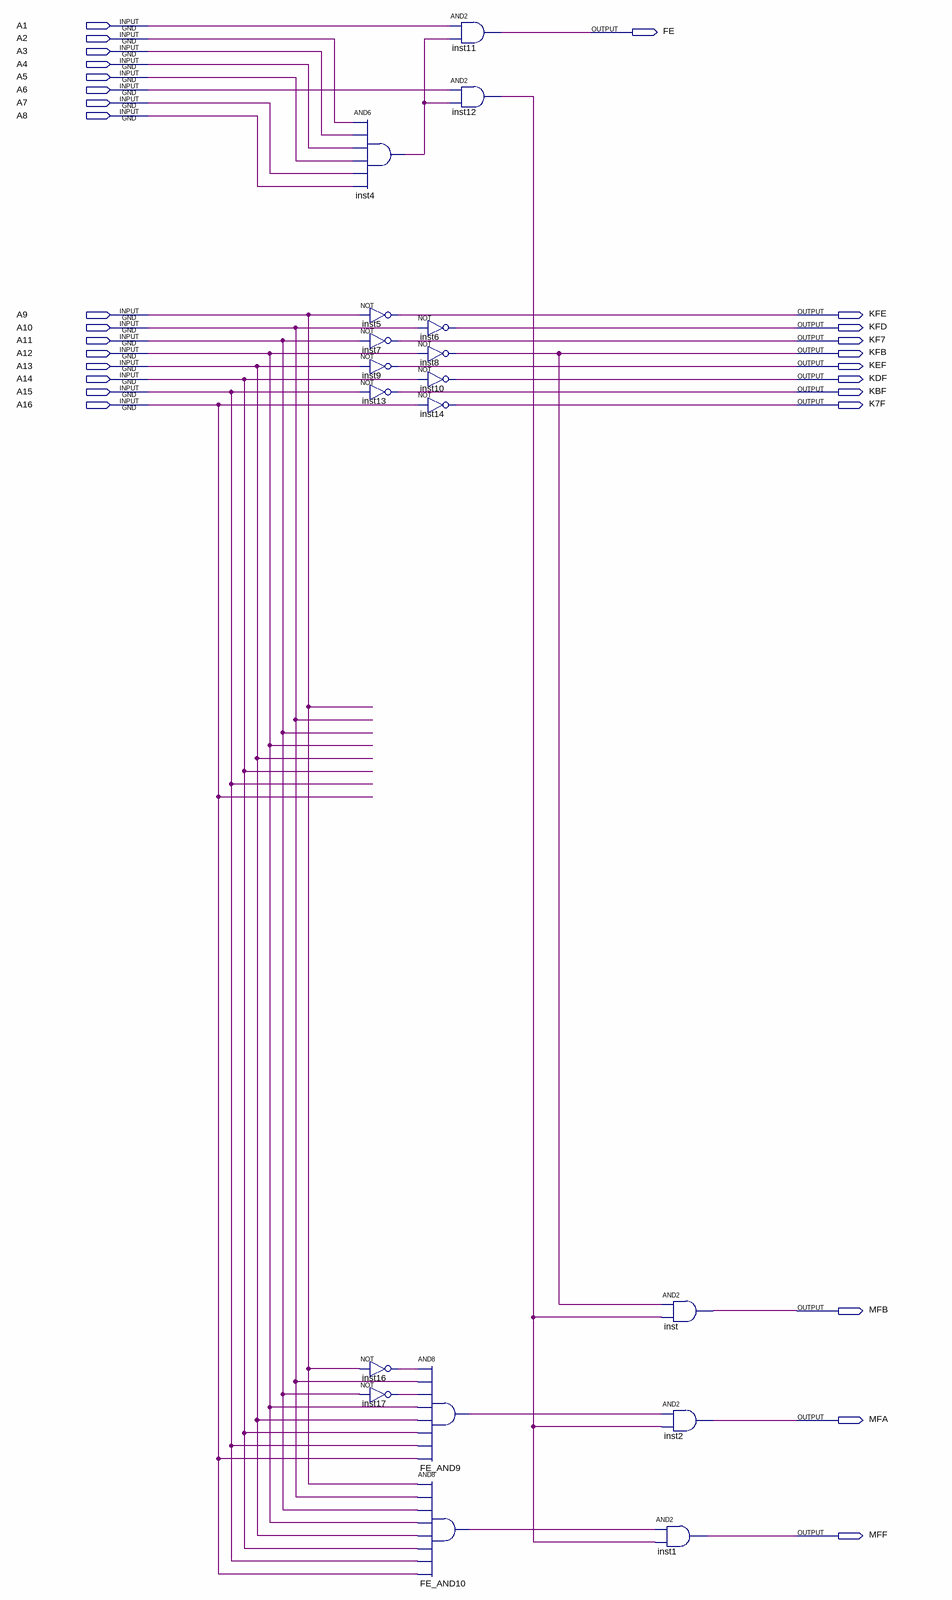
[diagram p0: schematic sheet]
// Quartus schematic decoder_addr.bdf as structural Verilog: 18 symbols, 28 pins
module decoder_addr (
  input  A1,
  input  A2,
  input  A3,
  input  A4,
  input  A5,
  input  A6,
  input  A7,
  input  A8,
  input  A9,
  input  A10,
  input  A11,
  input  A12,
  input  A13,
  input  A14,
  input  A15,
  input  A16,
  output FE,
  output KFE,
  output KFD,
  output KF7,
  output KFB,
  output KEF,
  output KDF,
  output KBF,
  output K7F,
  output MFB,
  output MFA,
  output MFF
);

  wire FE_AND9_out, FE_AND10_out, inst4_out, inst12_out, inst16_out, inst17_out;

  and inst4 (inst4_out, A2, A3, A4, A5, A7, A8);
  not inst5 (KFE, A9);
  not inst7 (KF7, A11);
  not inst9 (KEF, A13);
  not inst13 (KBF, A15);
  not inst16 (inst16_out, A9);
  not inst17 (inst17_out, A11);
  not inst6 (KFD, A10);
  not inst8 (KFB, A12);
  not inst10 (KDF, A14);
  not inst14 (K7F, A16);
  and FE_AND9 (FE_AND9_out, inst16_out, A10, inst17_out, A12, A13, A14, A15, A16);
  and FE_AND10 (FE_AND10_out, A9, A10, A11, A12, A13, A14, A15, A16);
  and inst11 (FE, A1, inst4_out);
  and inst12 (inst12_out, A6, inst4_out);
  and inst (MFB, KFB, inst12_out);
  and inst2 (MFA, FE_AND9_out, inst12_out);
  and inst1 (MFF, FE_AND10_out, inst12_out);
endmodule
